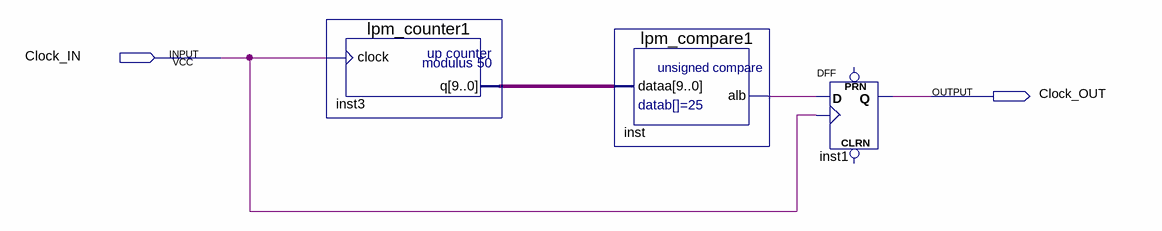
[diagram p0: schematic sheet]
// Quartus schematic freqDiv_1MHz.bdf as structural Verilog: 3 symbols, 2 pins
module freqDiv_1MHz (
  input  Clock_IN,
  output Clock_OUT
);

  wire inst_alb;
  wire [9:0] inst3_q;

  lpm_counter1 inst3 (.clock(Clock_IN), .q(inst3_q));
  lpm_compare1 inst (.dataa(inst3_q), .alb(inst_alb));
  DFF inst1 (.CLK(Clock_IN), .D(inst_alb), .Q(Clock_OUT));  // open: CLRN, PRN
endmodule
